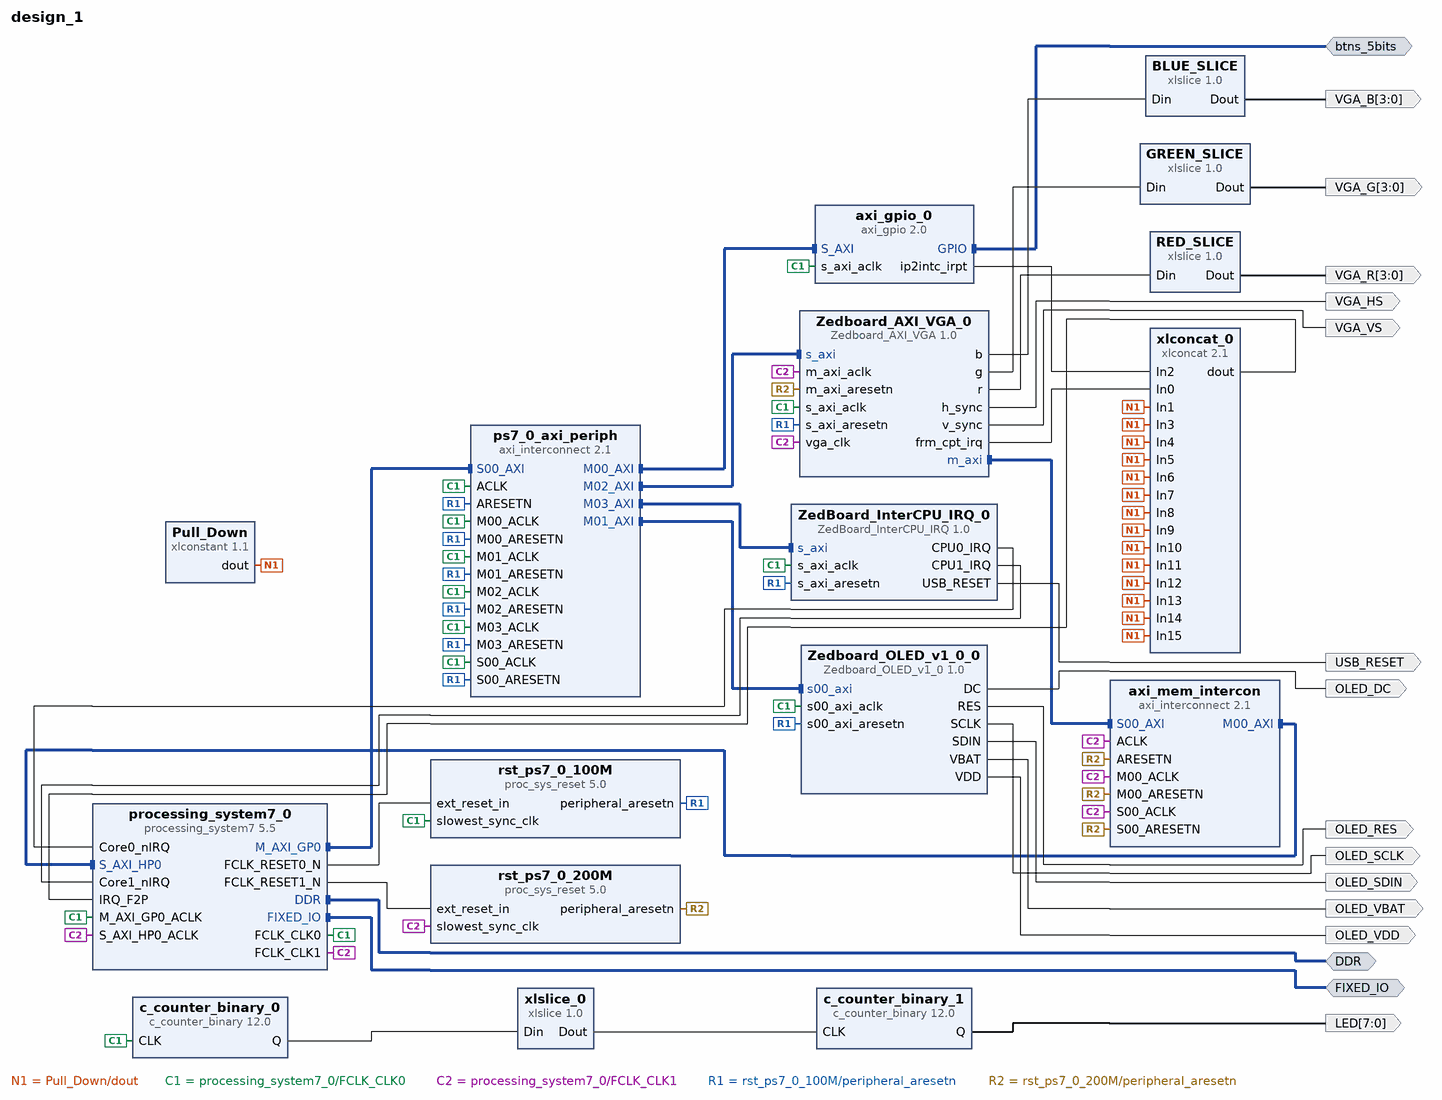
[diagram p0: block diagram of the top level]
# Vivado block design design_1, xc7z020clg484-1, Vivado 2023.1
create_bd_design design_1

create_bd_intf_port -mode Master -vlnv xilinx.com:interface:gpio_rtl:1.0 btns_5bits
create_bd_intf_port -mode Master -vlnv xilinx.com:interface:ddrx_rtl:1.0 DDR
create_bd_intf_port -mode Master -vlnv xilinx.com:display_processing_system7:fixedio_rtl:1.0 FIXED_IO
create_bd_port -dir O -type rst USB_RESET
create_bd_port -dir O OLED_SDIN
create_bd_port -dir O OLED_VBAT
create_bd_port -dir O OLED_RES
create_bd_port -dir O OLED_DC
create_bd_port -dir O OLED_SCLK
create_bd_port -dir O OLED_VDD
create_bd_port -dir O VGA_HS
create_bd_port -dir O VGA_VS
create_bd_port -dir O -from 3 -to 0 VGA_R
create_bd_port -dir O -from 3 -to 0 VGA_G
create_bd_port -dir O -from 3 -to 0 VGA_B
create_bd_port -dir O -from 7 -to 0 -type data LED

create_bd_cell -type ip -vlnv xilinx.com:ip:processing_system7:5.5 processing_system7_0
set_property -dict [list \
  CONFIG.PCW_APU_PERIPHERAL_FREQMHZ 666.666667 \
  CONFIG.PCW_CORE0_IRQ_INTR 1 \
  CONFIG.PCW_CORE1_IRQ_INTR 1 \
  CONFIG.PCW_ENET0_ENET0_IO {MIO 16 .. 27} \
  CONFIG.PCW_ENET0_GRP_MDIO_ENABLE 1 \
  CONFIG.PCW_ENET0_GRP_MDIO_IO {MIO 52 .. 53} \
  CONFIG.PCW_ENET0_PERIPHERAL_ENABLE 1 \
  CONFIG.PCW_ENET0_RESET_ENABLE 0 \
  CONFIG.PCW_ENET_RESET_ENABLE 1 \
  CONFIG.PCW_ENET_RESET_SELECT {Share reset pin} \
  CONFIG.PCW_EN_CLK1_PORT 1 \
  CONFIG.PCW_EN_RST1_PORT 1 \
  CONFIG.PCW_FCLK_CLK1_BUF TRUE \
  CONFIG.PCW_FPGA0_PERIPHERAL_FREQMHZ 100.000000 \
  CONFIG.PCW_FPGA1_PERIPHERAL_FREQMHZ 200.000000 \
  CONFIG.PCW_FPGA2_PERIPHERAL_FREQMHZ 50.000000 \
  CONFIG.PCW_FPGA_FCLK1_ENABLE 1 \
  CONFIG.PCW_GPIO_MIO_GPIO_ENABLE 1 \
  CONFIG.PCW_GPIO_MIO_GPIO_IO MIO \
  CONFIG.PCW_I2C0_GRP_INT_ENABLE 0 \
  CONFIG.PCW_I2C0_I2C0_IO {MIO 14 .. 15} \
  CONFIG.PCW_I2C0_PERIPHERAL_ENABLE 1 \
  CONFIG.PCW_I2C0_RESET_ENABLE 1 \
  CONFIG.PCW_I2C0_RESET_IO {MIO 0} \
  CONFIG.PCW_I2C_PERIPHERAL_FREQMHZ 111.111115 \
  CONFIG.PCW_I2C_RESET_ENABLE 1 \
  CONFIG.PCW_I2C_RESET_SELECT {Share reset pin} \
  CONFIG.PCW_IRQ_F2P_INTR 1 \
  CONFIG.PCW_PRESET_BANK1_VOLTAGE {LVCMOS 1.8V} \
  CONFIG.PCW_QSPI_PERIPHERAL_ENABLE 0 \
  CONFIG.PCW_SD0_GRP_CD_ENABLE 1 \
  CONFIG.PCW_SD0_GRP_CD_IO {MIO 47} \
  CONFIG.PCW_SD0_GRP_WP_ENABLE 1 \
  CONFIG.PCW_SD0_GRP_WP_IO {MIO 46} \
  CONFIG.PCW_SD0_PERIPHERAL_ENABLE 1 \
  CONFIG.PCW_SD0_SD0_IO {MIO 40 .. 45} \
  CONFIG.PCW_SDIO_PERIPHERAL_FREQMHZ 50 \
  CONFIG.PCW_UART1_PERIPHERAL_ENABLE 1 \
  CONFIG.PCW_UART1_UART1_IO {MIO 48 .. 49} \
  CONFIG.PCW_UART_PERIPHERAL_FREQMHZ 50 \
  CONFIG.PCW_UIPARAM_DDR_FREQ_MHZ 533.333313 \
  CONFIG.PCW_UIPARAM_DDR_PARTNO {MT41J128M16 HA-15E} \
  CONFIG.PCW_USB0_PERIPHERAL_ENABLE 1 \
  CONFIG.PCW_USB0_RESET_ENABLE 0 \
  CONFIG.PCW_USB0_USB0_IO {MIO 28 .. 39} \
  CONFIG.PCW_USB_RESET_ENABLE 1 \
  CONFIG.PCW_USB_RESET_SELECT {Share reset pin} \
  CONFIG.PCW_USE_FABRIC_INTERRUPT 1 \
  CONFIG.PCW_USE_S_AXI_HP0 1 \
  CONFIG.preset ZedBoard \
] [get_bd_cells processing_system7_0]
# 224 more settings of processing_system7_0 are not shown: defaults, MIO pin electricals, DDR timing, and values the tool derives
create_bd_cell -type ip -vlnv xilinx.com:ip:proc_sys_reset:5.0 rst_ps7_0_100M
create_bd_cell -type ip -vlnv xilinx.com:ip:xlconcat:2.1 xlconcat_0
set_property -dict {CONFIG.NUM_PORTS 16} [get_bd_cells xlconcat_0]
create_bd_cell -type ip -vlnv xilinx.com:ip:proc_sys_reset:5.0 rst_ps7_0_200M
create_bd_cell -type ip -vlnv xilinx.com:ip:xlslice:1.0 RED_SLICE
set_property -dict {CONFIG.DIN_FROM 7 CONFIG.DIN_TO 4 CONFIG.DIN_WIDTH 8 CONFIG.DOUT_WIDTH 4} [get_bd_cells RED_SLICE]
create_bd_cell -type ip -vlnv xilinx.com:ip:xlslice:1.0 GREEN_SLICE
set_property -dict {CONFIG.DIN_FROM 7 CONFIG.DIN_TO 4 CONFIG.DIN_WIDTH 8 CONFIG.DOUT_WIDTH 4} [get_bd_cells GREEN_SLICE]
create_bd_cell -type ip -vlnv xilinx.com:ip:xlslice:1.0 BLUE_SLICE
set_property -dict {CONFIG.DIN_FROM 7 CONFIG.DIN_TO 4 CONFIG.DIN_WIDTH 8 CONFIG.DOUT_WIDTH 4} [get_bd_cells BLUE_SLICE]
create_bd_cell -type ip -vlnv xilinx.com:ip:xlslice:1.0 xlslice_0
set_property -dict {CONFIG.DIN_FROM 21 CONFIG.DIN_TO 21 CONFIG.DIN_WIDTH 22 CONFIG.DOUT_WIDTH 1} [get_bd_cells xlslice_0]
create_bd_cell -type ip -vlnv PJBES:user:ZedBoard_InterCPU_IRQ:1.0 ZedBoard_InterCPU_IRQ_0
create_bd_cell -type ip -vlnv PJBES:user:Zedboard_AXI_VGA:1.0 Zedboard_AXI_VGA_0
create_bd_cell -type ip -vlnv PJBES:user:Zedboard_OLED_v1_0:1.0 Zedboard_OLED_v1_0_0
create_bd_cell -type ip -vlnv xilinx.com:ip:axi_gpio:2.0 axi_gpio_0
set_property -dict [list \
  CONFIG.C_INTERRUPT_PRESENT 1 \
  CONFIG.GPIO_BOARD_INTERFACE btns_5bits \
  CONFIG.USE_BOARD_FLOW true \
] [get_bd_cells axi_gpio_0]
create_bd_cell -type ip -vlnv xilinx.com:ip:axi_interconnect:2.1 axi_mem_intercon
set_property -dict {CONFIG.NUM_MI 1} [get_bd_cells axi_mem_intercon]
create_bd_cell -type ip -vlnv xilinx.com:ip:c_counter_binary:12.0 c_counter_binary_0
set_property -dict {CONFIG.Output_Width 22} [get_bd_cells c_counter_binary_0]
create_bd_cell -type ip -vlnv xilinx.com:ip:c_counter_binary:12.0 c_counter_binary_1
set_property -dict {CONFIG.Output_Width 8} [get_bd_cells c_counter_binary_1]
create_bd_cell -type ip -vlnv xilinx.com:ip:axi_interconnect:2.1 ps7_0_axi_periph
set_property -dict {CONFIG.NUM_MI 4} [get_bd_cells ps7_0_axi_periph]
create_bd_cell -type ip -vlnv xilinx.com:ip:xlconstant:1.1 Pull_Down
set_property -dict {CONFIG.CONST_VAL 0} [get_bd_cells Pull_Down]

# ---- connections ----

connect_bd_intf_net [get_bd_intf_pins Zedboard_AXI_VGA_0/m_axi] [get_bd_intf_pins axi_mem_intercon/S00_AXI]
connect_bd_intf_net [get_bd_intf_ports btns_5bits] [get_bd_intf_pins axi_gpio_0/GPIO]
connect_bd_intf_net [get_bd_intf_pins axi_mem_intercon/M00_AXI] [get_bd_intf_pins processing_system7_0/S_AXI_HP0]
connect_bd_intf_net [get_bd_intf_ports DDR] [get_bd_intf_pins processing_system7_0/DDR]
connect_bd_intf_net [get_bd_intf_ports FIXED_IO] [get_bd_intf_pins processing_system7_0/FIXED_IO]
connect_bd_intf_net [get_bd_intf_pins processing_system7_0/M_AXI_GP0] [get_bd_intf_pins ps7_0_axi_periph/S00_AXI]
connect_bd_intf_net [get_bd_intf_pins ps7_0_axi_periph/M00_AXI] [get_bd_intf_pins axi_gpio_0/S_AXI]
connect_bd_intf_net [get_bd_intf_pins ps7_0_axi_periph/M01_AXI] [get_bd_intf_pins Zedboard_OLED_v1_0_0/s00_axi]
connect_bd_intf_net [get_bd_intf_pins ps7_0_axi_periph/M02_AXI] [get_bd_intf_pins Zedboard_AXI_VGA_0/s_axi]
connect_bd_intf_net [get_bd_intf_pins ps7_0_axi_periph/M03_AXI] [get_bd_intf_pins ZedBoard_InterCPU_IRQ_0/s_axi]
connect_bd_net [get_bd_pins BLUE_SLICE/Dout] [get_bd_ports VGA_B]
connect_bd_net [get_bd_pins GREEN_SLICE/Dout] [get_bd_ports VGA_G]
connect_bd_net [get_bd_pins Pull_Down/dout] \
  [get_bd_pins xlconcat_0/In3] [get_bd_pins xlconcat_0/In4] [get_bd_pins xlconcat_0/In5] [get_bd_pins xlconcat_0/In6] \
  [get_bd_pins xlconcat_0/In7] [get_bd_pins xlconcat_0/In8] [get_bd_pins xlconcat_0/In9] [get_bd_pins xlconcat_0/In10] \
  [get_bd_pins xlconcat_0/In11] [get_bd_pins xlconcat_0/In12] [get_bd_pins xlconcat_0/In13] [get_bd_pins xlconcat_0/In14] \
  [get_bd_pins xlconcat_0/In15] [get_bd_pins xlconcat_0/In1]
connect_bd_net [get_bd_pins RED_SLICE/Dout] [get_bd_ports VGA_R]
connect_bd_net [get_bd_pins ZedBoard_InterCPU_IRQ_0/CPU0_IRQ] [get_bd_pins processing_system7_0/Core0_nIRQ]
connect_bd_net [get_bd_pins ZedBoard_InterCPU_IRQ_0/CPU1_IRQ] [get_bd_pins processing_system7_0/Core1_nIRQ]
connect_bd_net [get_bd_pins ZedBoard_InterCPU_IRQ_0/USB_RESET] [get_bd_ports USB_RESET]
connect_bd_net [get_bd_pins Zedboard_AXI_VGA_0/b] [get_bd_pins BLUE_SLICE/Din]
connect_bd_net [get_bd_pins Zedboard_AXI_VGA_0/frm_cpt_irq] [get_bd_pins xlconcat_0/In0]
connect_bd_net [get_bd_pins Zedboard_AXI_VGA_0/g] [get_bd_pins GREEN_SLICE/Din]
connect_bd_net [get_bd_pins Zedboard_AXI_VGA_0/h_sync] [get_bd_ports VGA_HS]
connect_bd_net [get_bd_pins Zedboard_AXI_VGA_0/r] [get_bd_pins RED_SLICE/Din]
connect_bd_net [get_bd_pins Zedboard_AXI_VGA_0/v_sync] [get_bd_ports VGA_VS]
connect_bd_net [get_bd_pins Zedboard_OLED_v1_0_0/DC] [get_bd_ports OLED_DC]
connect_bd_net [get_bd_pins Zedboard_OLED_v1_0_0/RES] [get_bd_ports OLED_RES]
connect_bd_net [get_bd_pins Zedboard_OLED_v1_0_0/SCLK] [get_bd_ports OLED_SCLK]
connect_bd_net [get_bd_pins Zedboard_OLED_v1_0_0/SDIN] [get_bd_ports OLED_SDIN]
connect_bd_net [get_bd_pins Zedboard_OLED_v1_0_0/VBAT] [get_bd_ports OLED_VBAT]
connect_bd_net [get_bd_pins Zedboard_OLED_v1_0_0/VDD] [get_bd_ports OLED_VDD]
connect_bd_net [get_bd_pins axi_gpio_0/ip2intc_irpt] [get_bd_pins xlconcat_0/In2]
connect_bd_net [get_bd_pins c_counter_binary_0/Q] [get_bd_pins xlslice_0/Din]
connect_bd_net [get_bd_pins c_counter_binary_1/Q] [get_bd_ports LED]
connect_bd_net [get_bd_pins processing_system7_0/FCLK_CLK0] \
  [get_bd_pins processing_system7_0/M_AXI_GP0_ACLK] [get_bd_pins rst_ps7_0_100M/slowest_sync_clk] \
  [get_bd_pins ZedBoard_InterCPU_IRQ_0/s_axi_aclk] [get_bd_pins Zedboard_AXI_VGA_0/s_axi_aclk] \
  [get_bd_pins Zedboard_OLED_v1_0_0/s00_axi_aclk] [get_bd_pins axi_gpio_0/s_axi_aclk] [get_bd_pins c_counter_binary_0/CLK] \
  [get_bd_pins ps7_0_axi_periph/ACLK] [get_bd_pins ps7_0_axi_periph/S00_ACLK] [get_bd_pins ps7_0_axi_periph/M00_ACLK] \
  [get_bd_pins ps7_0_axi_periph/M01_ACLK] [get_bd_pins ps7_0_axi_periph/M02_ACLK] [get_bd_pins ps7_0_axi_periph/M03_ACLK]
connect_bd_net [get_bd_pins processing_system7_0/FCLK_CLK1] \
  [get_bd_pins processing_system7_0/S_AXI_HP0_ACLK] [get_bd_pins rst_ps7_0_200M/slowest_sync_clk] \
  [get_bd_pins Zedboard_AXI_VGA_0/vga_clk] [get_bd_pins Zedboard_AXI_VGA_0/m_axi_aclk] [get_bd_pins axi_mem_intercon/ACLK] \
  [get_bd_pins axi_mem_intercon/S00_ACLK] [get_bd_pins axi_mem_intercon/M00_ACLK]
connect_bd_net [get_bd_pins processing_system7_0/FCLK_RESET0_N] [get_bd_pins rst_ps7_0_100M/ext_reset_in]
connect_bd_net [get_bd_pins processing_system7_0/FCLK_RESET1_N] [get_bd_pins rst_ps7_0_200M/ext_reset_in]
connect_bd_net [get_bd_pins rst_ps7_0_100M/peripheral_aresetn] \
  [get_bd_pins ZedBoard_InterCPU_IRQ_0/s_axi_aresetn] [get_bd_pins Zedboard_AXI_VGA_0/s_axi_aresetn] \
  [get_bd_pins Zedboard_OLED_v1_0_0/s00_axi_aresetn] [get_bd_pins ps7_0_axi_periph/ARESETN] \
  [get_bd_pins ps7_0_axi_periph/S00_ARESETN] [get_bd_pins ps7_0_axi_periph/M00_ARESETN] \
  [get_bd_pins ps7_0_axi_periph/M01_ARESETN] [get_bd_pins ps7_0_axi_periph/M02_ARESETN] \
  [get_bd_pins ps7_0_axi_periph/M03_ARESETN]
connect_bd_net [get_bd_pins rst_ps7_0_200M/peripheral_aresetn] \
  [get_bd_pins Zedboard_AXI_VGA_0/m_axi_aresetn] [get_bd_pins axi_mem_intercon/ARESETN] \
  [get_bd_pins axi_mem_intercon/S00_ARESETN] [get_bd_pins axi_mem_intercon/M00_ARESETN]
connect_bd_net [get_bd_pins xlconcat_0/dout] [get_bd_pins processing_system7_0/IRQ_F2P]
connect_bd_net [get_bd_pins xlslice_0/Dout] [get_bd_pins c_counter_binary_1/CLK]

# ---- address map ----
assign_bd_address -offset 0x40000000 -range 4K -target_address_space [get_bd_addr_spaces processing_system7_0/Data] [get_bd_addr_segs Zedboard_AXI_VGA_0/s_axi/reg0]
assign_bd_address -offset 0x40001000 -range 4K -target_address_space [get_bd_addr_spaces processing_system7_0/Data] [get_bd_addr_segs ZedBoard_InterCPU_IRQ_0/s_axi/reg0]
assign_bd_address -offset 0x40002000 -range 4K -target_address_space [get_bd_addr_spaces processing_system7_0/Data] [get_bd_addr_segs Zedboard_OLED_v1_0_0/s00_axi/reg0]
assign_bd_address -offset 0x41200000 -range 64K -target_address_space [get_bd_addr_spaces processing_system7_0/Data] [get_bd_addr_segs axi_gpio_0/S_AXI/Reg]
assign_bd_address -offset 0x00000000 -range 512M -target_address_space [get_bd_addr_spaces Zedboard_AXI_VGA_0/m_axi] [get_bd_addr_segs processing_system7_0/S_AXI_HP0/HP0_DDR_LOWOCM]

validate_bd_design
save_bd_design
